# Altium schematic sheet altium_breakout.SchDoc
size A4
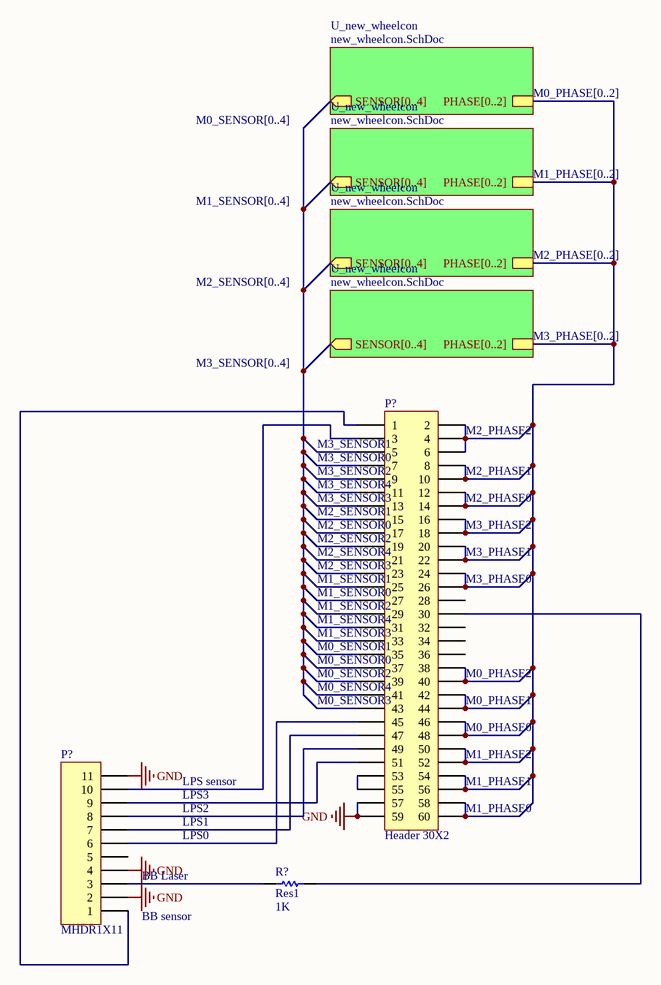
[diagram p0: altium_breakout.SchDoc]

## Parts
(Parts that share a designator on the sheet are numbered #1, #2 ... from top to bottom, then left to right.)
P?#1  Header 30X2  [HDR2X30]
P?#2  MHDR1X11  [MHDR1X11]
R?  Res1  value 1K  [AXIAL-0.3]

## Sub-sheets
U_new_wheelcon = new_wheelcon.SchDoc: PHASE[0..2], SENSOR[0..4] (out)
U_new_wheelcon = new_wheelcon.SchDoc: PHASE[0..2], SENSOR[0..4] (out)
U_new_wheelcon = new_wheelcon.SchDoc: PHASE[0..2], SENSOR[0..4] (out)
U_new_wheelcon = new_wheelcon.SchDoc: PHASE[0..2], SENSOR[0..4] (out)

## Nets
GND: P?#1.57 P?#1.59 P?#2.2 P?#2.4 P?#2.11
NetP?#1_1: P?#1.1 P?#2.1
NetP?#1_2: P?#1.2 P?#1.4 P?#1.6 P?#1.8 P?#1.10 P?#1.12 P?#1.14 P?#1.16 P?#1.18 P?#1.20 P?#1.22 P?#1.24 P?#1.26 P?#1.38 P?#1.40 P?#1.42 P?#1.44 P?#1.46 P?#1.48 P?#1.50 P?#1.52 P?#1.54 P?#1.56 P?#1.58 P?#1.60 ; sheet U_new_wheelcon/PHASE[0..2], sheet U_new_wheelcon/PHASE[0..2], sheet U_new_wheelcon/PHASE[0..2], sheet U_new_wheelcon/PHASE[0..2]
NetP?#1_3: P?#1.3 P?#2.10
NetP?#1_5: P?#1.5 P?#1.7 P?#1.9 P?#1.11 P?#1.13 P?#1.15 P?#1.17 P?#1.19 P?#1.21 P?#1.23 P?#1.25 P?#1.27 P?#1.29 P?#1.31 P?#1.33 P?#1.35 P?#1.37 P?#1.39 P?#1.41 P?#1.43 ; sheet U_new_wheelcon/SENSOR[0..4], sheet U_new_wheelcon/SENSOR[0..4], sheet U_new_wheelcon/SENSOR[0..4], sheet U_new_wheelcon/SENSOR[0..4]
NetP?#1_30: P?#1.30 R?.2
NetP?#1_45: P?#1.45 P?#2.6
NetP?#1_47: P?#1.47 P?#2.7
NetP?#1_49: P?#1.49 P?#2.8
NetP?#1_51: P?#1.51 P?#2.9
NetP?#1_53: P?#1.53 P?#1.55
NetP?#2_3: P?#2.3 R?.1

Not connected (* = marked no-connect by the designer): P?#1 28 32 34 36; P?#2 5

## Notes on the sheet
- M0_SENSOR[0..4]
- M0_PHASE[0..2]
- M1_PHASE[0..2]
- M1_SENSOR[0..4]
- M2_PHASE[0..2]
- M2_SENSOR[0..4]
- M3_SENSOR[0..4]
- M3_PHASE[0..2]
- (near P?#1) M3_SENSOR1
- (near P?#1) M3_SENSOR0
- (near P?#1) M2_PHASE2
- (near P?#1) M3_SENSOR2
- (near P?#1) M3_SENSOR4
- (near P?#1) M3_SENSOR3
- (near P?#1) M2_SENSOR1
- (near P?#1) M2_SENSOR0
- (near P?#1) M2_PHASE1
- (near P?#1) M2_PHASE0
- (near P?#1) M3_PHASE2
- (near P?#1) M2_SENSOR2
- (near P?#1) M2_SENSOR4
- (near P?#1) M2_SENSOR3
- (near P?#1) M1_SENSOR1
- (near P?#1) M1_SENSOR0
- (near P?#1) M3_PHASE1
- (near P?#1) M3_PHASE0
- (near P?#1) M1_SENSOR2
- (near P?#1) M1_SENSOR4
- (near P?#1) M1_SENSOR3
- (near P?#1) M0_SENSOR1
- (near P?#1) M0_SENSOR0
- (near P?#1) M0_SENSOR2
- (near P?#1) M0_SENSOR4
- (near P?#1) M0_SENSOR3
- (near P?#1) M0_PHASE2
- (near P?#1) M0_PHASE1
- (near P?#1) M0_PHASE0
- LPS sensor
- LPS3
- (near P?#1) M1_PHASE2
- (near P?#1) M1_PHASE1
- LPS2
- LPS1
- LPS0
- (near P?#1) M1_PHASE0
- (near P?#2) BB Laser
- (near P?#2) BB sensor

## Library data of the parts
P?#1 = Header 30X2: Header, 30-Pin, Dual row; LatestRevisionDate: 17-Jul-2002; LatestRevisionNote: Re-released for DXP Platform.; Publisher: Altium Limited
P?#2 = MHDR1X11: Header, 11-Pin; LatestRevisionDate: 17-Jul-2002; LatestRevisionNote: Re-released for DXP Platform.; Publisher: Altium Limited
R? = Res1: Resistor; Published: 8-Jun-2000; LatestRevisionDate: 17-Jul-2002; LatestRevisionNote: Re-released for DXP Platform.; PackageReference: AXIAL-0.3; Publisher: Altium Limited; PackageDescription: Axial Device, Thru-Hole; 2 Leads; 0.3 in Pin Spacing